# Altium schematic sheet MainDAC.SchDoc
size A2
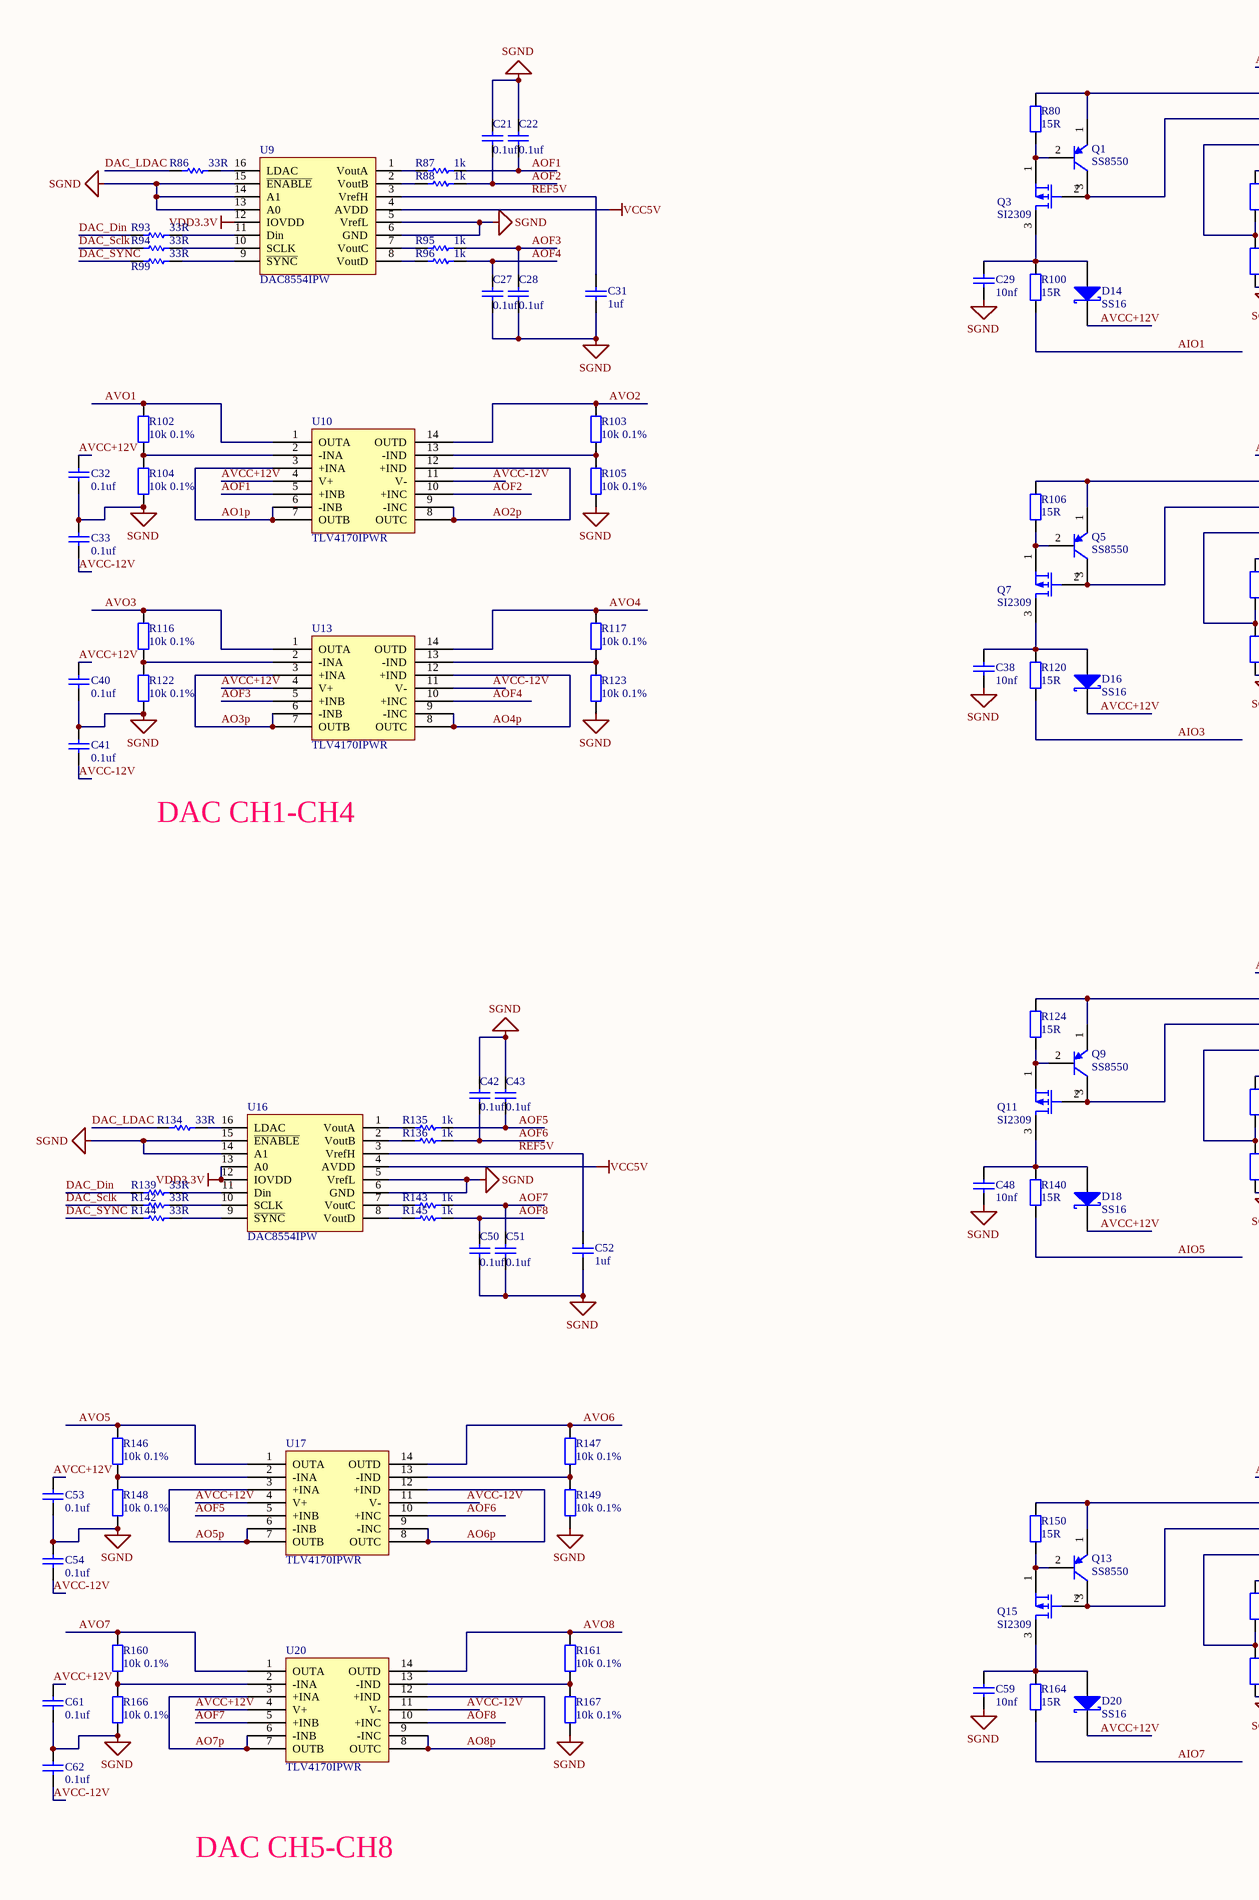
[diagram p0: MainDAC.SchDoc, left]
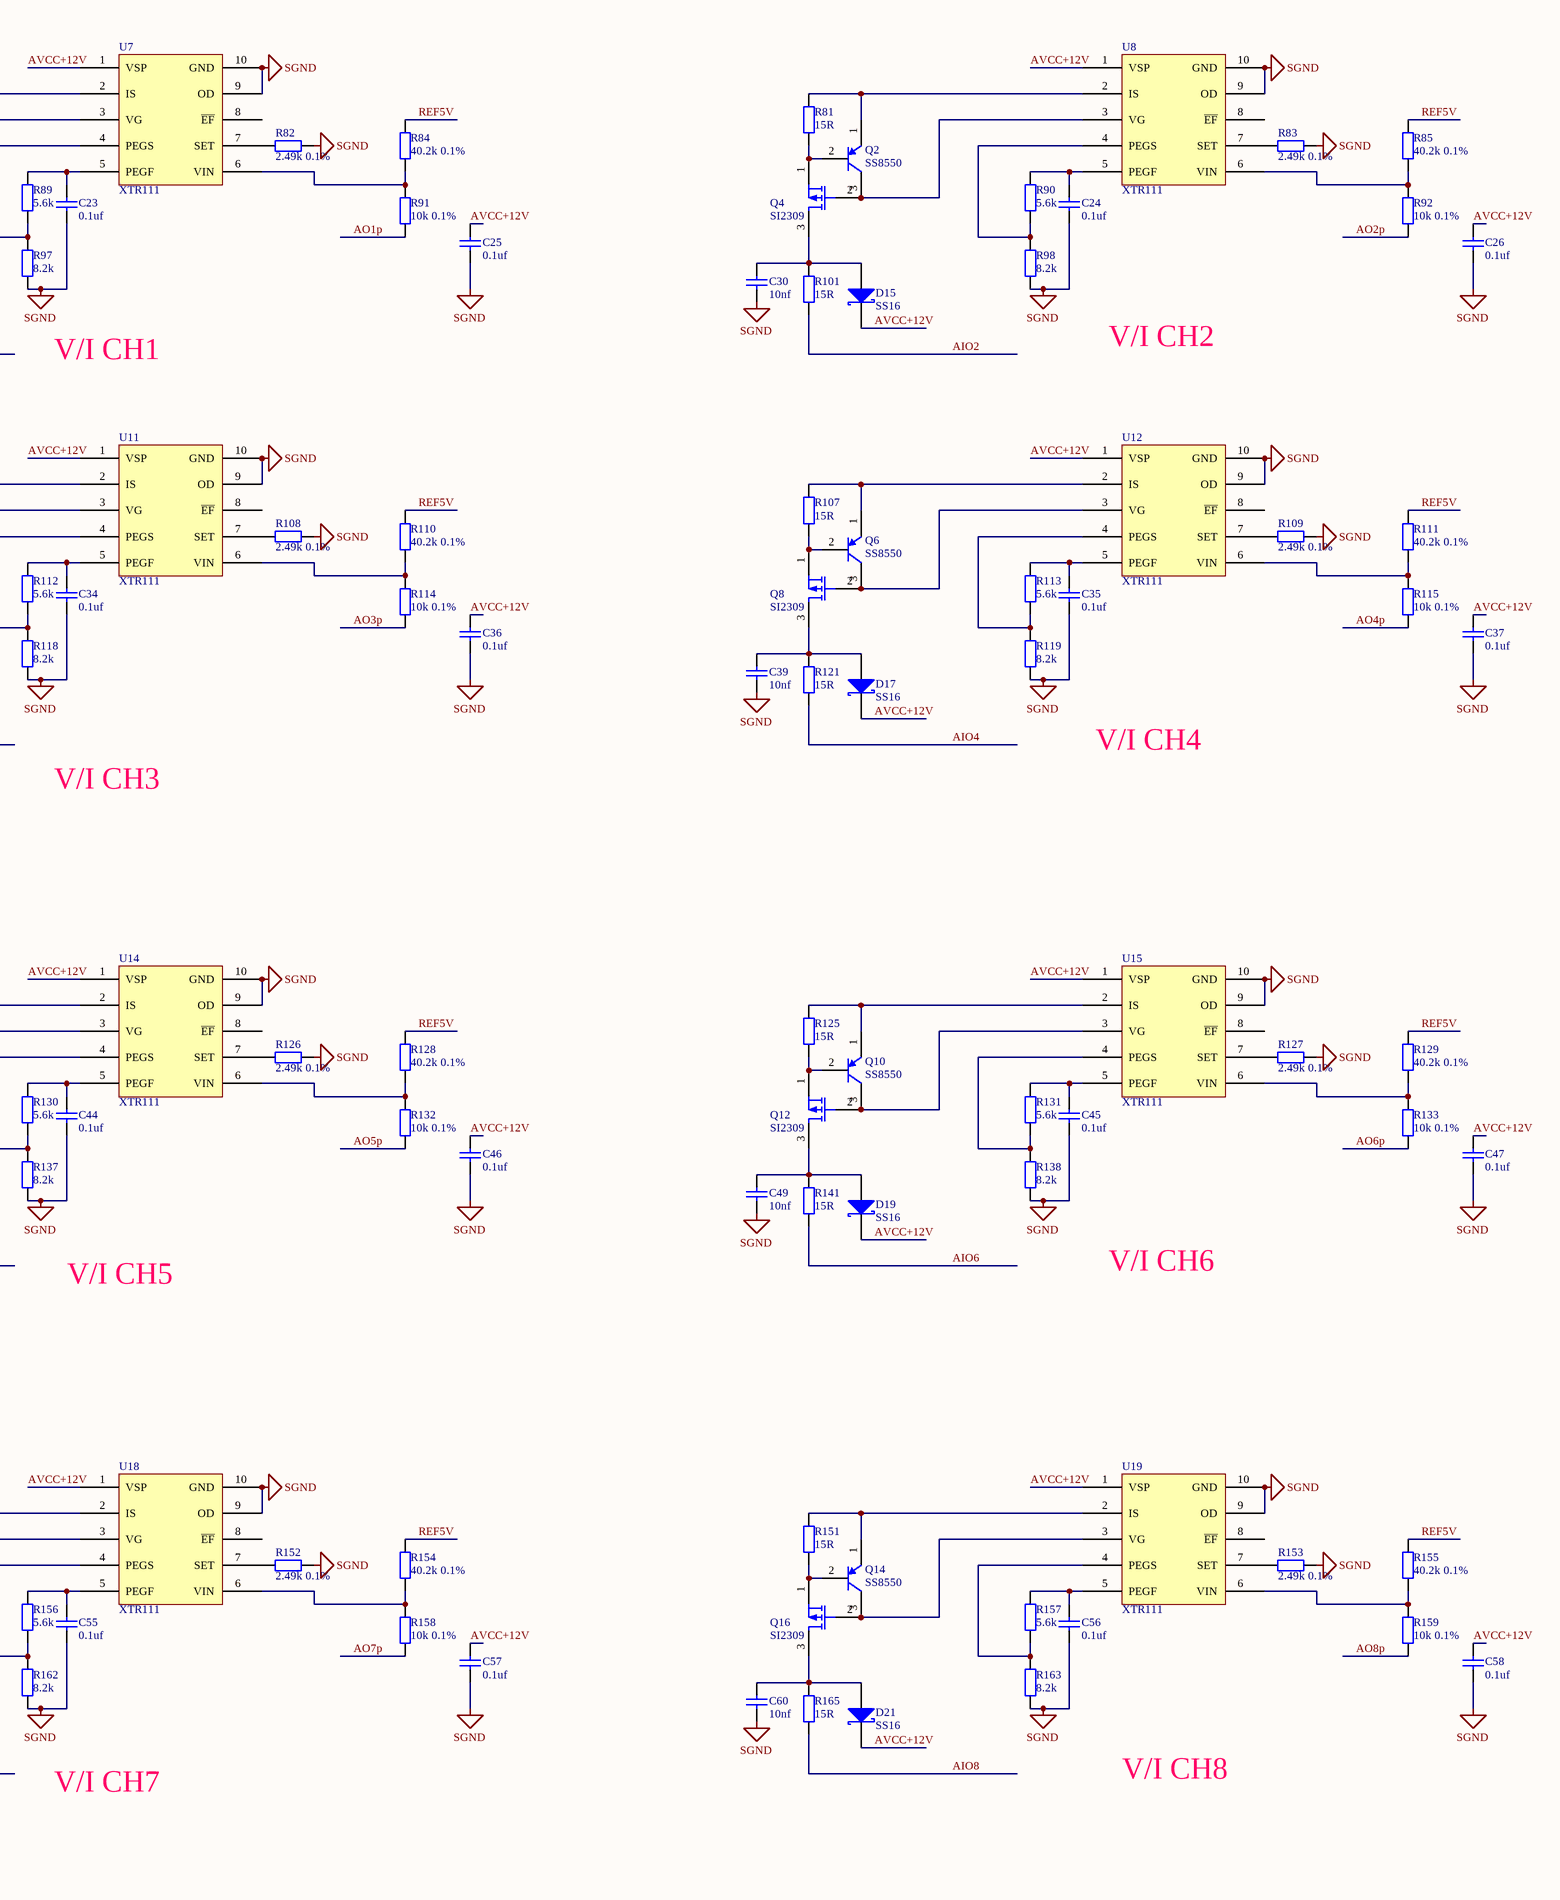
[diagram p1: MainDAC.SchDoc, right]

## Parts
C21  value 0.1uf  [C0805]  (hidden comment: Cap)
C22  value 0.1uf  [C0805]  (hidden comment: Cap)
C23  value 0.1uf  [C0805]  (hidden comment: Cap)
C24  value 0.1uf  [C0805]  (hidden comment: Cap)
C25  value 0.1uf  [C0805]  (hidden comment: Cap)
C26  value 0.1uf  [C0805]  (hidden comment: Cap)
C27  value 0.1uf  [C0805]  (hidden comment: Cap)
C28  value 0.1uf  [C0805]  (hidden comment: Cap)
C29  value 10nf  [C0805]  (hidden comment: Cap)
C30  value 10nf  [C0805]  (hidden comment: Cap)
C31  value 1uf  [C0805]  (hidden comment: Cap)
C32  value 0.1uf  [C0805]  (hidden comment: Cap)
C33  value 0.1uf  [C0805]  (hidden comment: Cap)
C34  value 0.1uf  [C0805]  (hidden comment: Cap)
C35  value 0.1uf  [C0805]  (hidden comment: Cap)
C36  value 0.1uf  [C0805]  (hidden comment: Cap)
C37  value 0.1uf  [C0805]  (hidden comment: Cap)
C38  value 10nf  [C0805]  (hidden comment: Cap)
C39  value 10nf  [C0805]  (hidden comment: Cap)
C40  value 0.1uf  [C0805]  (hidden comment: Cap)
C41  value 0.1uf  [C0805]  (hidden comment: Cap)
C42  value 0.1uf  [C0805]  (hidden comment: Cap)
C43  value 0.1uf  [C0805]  (hidden comment: Cap)
C44  value 0.1uf  [C0805]  (hidden comment: Cap)
C45  value 0.1uf  [C0805]  (hidden comment: Cap)
C46  value 0.1uf  [C0805]  (hidden comment: Cap)
C47  value 0.1uf  [C0805]  (hidden comment: Cap)
C48  value 10nf  [C0805]  (hidden comment: Cap)
C49  value 10nf  [C0805]  (hidden comment: Cap)
C50  value 0.1uf  [C0805]  (hidden comment: Cap)
C51  value 0.1uf  [C0805]  (hidden comment: Cap)
C52  value 1uf  [C0805]  (hidden comment: Cap)
C53  value 0.1uf  [C0805]  (hidden comment: Cap)
C54  value 0.1uf  [C0805]  (hidden comment: Cap)
C55  value 0.1uf  [C0805]  (hidden comment: Cap)
C56  value 0.1uf  [C0805]  (hidden comment: Cap)
C57  value 0.1uf  [C0805]  (hidden comment: Cap)
C58  value 0.1uf  [C0805]  (hidden comment: Cap)
C59  value 10nf  [C0805]  (hidden comment: Cap)
C60  value 10nf  [C0805]  (hidden comment: Cap)
C61  value 0.1uf  [C0805]  (hidden comment: Cap)
C62  value 0.1uf  [C0805]  (hidden comment: Cap)
D14  SS16  [SMB]
D15  SS16  [SMB]
D16  SS16  [SMB]
D17  SS16  [SMB]
D18  SS16  [SMB]
D19  SS16  [SMB]
D20  SS16  [SMB]
D21  SS16  [SMB]
Q1  SS8550  [sot-23]
Q2  SS8550  [sot-23]
Q3  SI2309  [sot-23]
Q4  SI2309  [sot-23]
Q5  SS8550  [sot-23]
Q6  SS8550  [sot-23]
Q7  SI2309  [sot-23]
Q8  SI2309  [sot-23]
Q9  SS8550  [sot-23]
Q10  SS8550  [sot-23]
Q11  SI2309  [sot-23]
Q12  SI2309  [sot-23]
Q13  SS8550  [sot-23]
Q14  SS8550  [sot-23]
Q15  SI2309  [sot-23]
Q16  SI2309  [sot-23]
R80  value 15R  [0805]  (hidden comment: Res2)
R81  value 15R  [0805]  (hidden comment: Res2)
R82  value 2.49k 0.1%  [0805]  (hidden comment: Res2)
R83  value 2.49k 0.1%  [0805]  (hidden comment: Res2)
R84  value 40.2k 0.1%  [0805]  (hidden comment: Res2)
R85  value 40.2k 0.1%  [0805]  (hidden comment: Res2)
R86  value 33R  [0805]  (hidden comment: Res Semi)
R87  value 1k  [0805]  (hidden comment: Res Semi)
R88  value 1k  [0805]  (hidden comment: Res Semi)
R89  value 5.6k  [0805]  (hidden comment: Res2)
R90  value 5.6k  [0805]  (hidden comment: Res2)
R91  value 10k 0.1%  [0805]  (hidden comment: Res2)
R92  value 10k 0.1%  [0805]  (hidden comment: Res2)
R93  value 33R  [0805]  (hidden comment: Res Semi)
R94  value 33R  [0805]  (hidden comment: Res Semi)
R95  value 1k  [0805]  (hidden comment: Res Semi)
R96  value 1k  [0805]  (hidden comment: Res Semi)
R97  value 8.2k  [0805]  (hidden comment: Res2)
R98  value 8.2k  [0805]  (hidden comment: Res2)
R99  value 33R  [0805]  (hidden comment: Res Semi)
R100  value 15R  [0805]  (hidden comment: Res2)
R101  value 15R  [0805]  (hidden comment: Res2)
R102  value 10k 0.1%  [0805]  (hidden comment: Res2)
R103  value 10k 0.1%  [0805]  (hidden comment: Res2)
R104  value 10k 0.1%  [0805]  (hidden comment: Res2)
R105  value 10k 0.1%  [0805]  (hidden comment: Res2)
R106  value 15R  [0805]  (hidden comment: Res2)
R107  value 15R  [0805]  (hidden comment: Res2)
R108  value 2.49k 0.1%  [0805]  (hidden comment: Res2)
R109  value 2.49k 0.1%  [0805]  (hidden comment: Res2)
R110  value 40.2k 0.1%  [0805]  (hidden comment: Res2)
R111  value 40.2k 0.1%  [0805]  (hidden comment: Res2)
R112  value 5.6k  [0805]  (hidden comment: Res2)
R113  value 5.6k  [0805]  (hidden comment: Res2)
R114  value 10k 0.1%  [0805]  (hidden comment: Res2)
R115  value 10k 0.1%  [0805]  (hidden comment: Res2)
R116  value 10k 0.1%  [0805]  (hidden comment: Res2)
R117  value 10k 0.1%  [0805]  (hidden comment: Res2)
R118  value 8.2k  [0805]  (hidden comment: Res2)
R119  value 8.2k  [0805]  (hidden comment: Res2)
R120  value 15R  [0805]  (hidden comment: Res2)
R121  value 15R  [0805]  (hidden comment: Res2)
R122  value 10k 0.1%  [0805]  (hidden comment: Res2)
R123  value 10k 0.1%  [0805]  (hidden comment: Res2)
R124  value 15R  [0805]  (hidden comment: Res2)
R125  value 15R  [0805]  (hidden comment: Res2)
R126  value 2.49k 0.1%  [0805]  (hidden comment: Res2)
R127  value 2.49k 0.1%  [0805]  (hidden comment: Res2)
R128  value 40.2k 0.1%  [0805]  (hidden comment: Res2)
R129  value 40.2k 0.1%  [0805]  (hidden comment: Res2)
R130  value 5.6k  [0805]  (hidden comment: Res2)
R131  value 5.6k  [0805]  (hidden comment: Res2)
R132  value 10k 0.1%  [0805]  (hidden comment: Res2)
R133  value 10k 0.1%  [0805]  (hidden comment: Res2)
R134  value 33R  [0805]  (hidden comment: Res Semi)
R135  value 1k  [0805]  (hidden comment: Res Semi)
R136  value 1k  [0805]  (hidden comment: Res Semi)
R137  value 8.2k  [0805]  (hidden comment: Res2)
R138  value 8.2k  [0805]  (hidden comment: Res2)
R139  value 33R  [0805]  (hidden comment: Res Semi)
R140  value 15R  [0805]  (hidden comment: Res2)
R141  value 15R  [0805]  (hidden comment: Res2)
R142  value 33R  [0805]  (hidden comment: Res Semi)
R143  value 1k  [0805]  (hidden comment: Res Semi)
R144  value 33R  [0805]  (hidden comment: Res Semi)
R145  value 1k  [0805]  (hidden comment: Res Semi)
R146  value 10k 0.1%  [0805]  (hidden comment: Res2)
R147  value 10k 0.1%  [0805]  (hidden comment: Res2)
R148  value 10k 0.1%  [0805]  (hidden comment: Res2)
R149  value 10k 0.1%  [0805]  (hidden comment: Res2)
R150  value 15R  [0805]  (hidden comment: Res2)
R151  value 15R  [0805]  (hidden comment: Res2)
R152  value 2.49k 0.1%  [0805]  (hidden comment: Res2)
R153  value 2.49k 0.1%  [0805]  (hidden comment: Res2)
R154  value 40.2k 0.1%  [0805]  (hidden comment: Res2)
R155  value 40.2k 0.1%  [0805]  (hidden comment: Res2)
R156  value 5.6k  [0805]  (hidden comment: Res2)
R157  value 5.6k  [0805]  (hidden comment: Res2)
R158  value 10k 0.1%  [0805]  (hidden comment: Res2)
R159  value 10k 0.1%  [0805]  (hidden comment: Res2)
R160  value 10k 0.1%  [0805]  (hidden comment: Res2)
R161  value 10k 0.1%  [0805]  (hidden comment: Res2)
R162  value 8.2k  [0805]  (hidden comment: Res2)
R163  value 8.2k  [0805]  (hidden comment: Res2)
R164  value 15R  [0805]  (hidden comment: Res2)
R165  value 15R  [0805]  (hidden comment: Res2)
R166  value 10k 0.1%  [0805]  (hidden comment: Res2)
R167  value 10k 0.1%  [0805]  (hidden comment: Res2)
U7  XTR111  [TSSOP-10_P]
U8  XTR111  [TSSOP-10_P]
U9  DAC8554IPW  [TSSOP16]
U10  TLV4170IPWR  [WSOP14*0.65]
U11  XTR111  [TSSOP-10_P]
U12  XTR111  [TSSOP-10_P]
U13  TLV4170IPWR  [WSOP14*0.65]
U14  XTR111  [TSSOP-10_P]
U15  XTR111  [TSSOP-10_P]
U16  DAC8554IPW  [TSSOP16]
U17  TLV4170IPWR  [WSOP14*0.65]
U18  XTR111  [TSSOP-10_P]
U19  XTR111  [TSSOP-10_P]
U20  TLV4170IPWR  [WSOP14*0.65]

## Nets
SGND: C21.1 C22.1 C23.2 C24.2 C25.2 C26.2 C27.2 C28.2 C29.2 C30.2 C31.1 C32.2 C33.1 C34.2 C35.2 C36.2 C37.2 C38.2 C39.2 C40.2 C41.1 C42.1 C43.1 C44.2 C45.2 C46.2 C47.2 C48.2 C49.2 C50.2 C51.2 C52.1 C53.2 C54.1 C55.2 C56.2 C57.2 C58.2 C59.2 C60.2 C61.2 C62.1 R82.2 R83.2 R97.2 R98.2 R104.2 R105.2 R108.2 R109.2 R118.2 R119.2 R122.2 R123.2 R126.2 R127.2 R137.2 R138.2 R148.2 R149.2 R152.2 R153.2 R162.2 R163.2 R166.2 R167.2 U7.9(OD) U7.10(GND) U8.9(OD) U8.10(GND) U9.5(VrefL) U9.6(GND) U9.13(A0) U9.14(A1) U9.15(~{ENABLE}) U11.9(OD) U11.10(GND) U12.9(OD) U12.10(GND) U14.9(OD) U14.10(GND) U15.9(OD) U15.10(GND) U16.5(VrefL) U16.6(GND) U16.14(A1) U16.15(~{ENABLE}) U18.9(OD) U18.10(GND) U19.9(OD) U19.10(GND)
VCC5V: U9.4(AVDD) U16.4(AVDD)
VDD3.3V: U9.12(IOVDD) U16.12(IOVDD) U16.13(A0)
AIO1: R100.2
AIO2: R101.2
AIO3: R120.2
AIO4: R121.2
AIO5: R140.2
AIO6: R141.2
AIO7: R164.2
AIO8: R165.2
AO1p: R91.2 U10.3(+INA) U10.6(-INB) U10.7(OUTB)
AO2p: R92.2 U10.8(OUTC) U10.9(-INC) U10.12(+IND)
AO3p: R114.2 U13.3(+INA) U13.6(-INB) U13.7(OUTB)
AO4p: R115.2 U13.8(OUTC) U13.9(-INC) U13.12(+IND)
AO5p: R132.2 U17.3(+INA) U17.6(-INB) U17.7(OUTB)
AO6p: R133.2 U17.8(OUTC) U17.9(-INC) U17.12(+IND)
AO7p: R158.2 U20.3(+INA) U20.6(-INB) U20.7(OUTB)
AO8p: R159.2 U20.8(OUTC) U20.9(-INC) U20.12(+IND)
AOF1: C22.2 R87.1 U10.5(+INB)
AOF2: C21.2 R88.1 U10.10(+INC)
AOF3: C28.1 R95.1 U13.5(+INB)
AOF4: C27.1 R96.1 U13.10(+INC)
AOF5: C43.2 R135.1 U17.5(+INB)
AOF6: C42.2 R136.1 U17.10(+INC)
AOF7: C51.1 R143.1 U20.5(+INB)
AOF8: C50.1 R145.1 U20.10(+INC)
AVCC+12V: C25.1 C26.1 C32.1 C36.1 C37.1 C40.1 C46.1 C47.1 C53.1 C57.1 C58.1 C61.1 D14.2(K) D15.2(K) D16.2(K) D17.2(K) D18.2(K) D19.2(K) D20.2(K) D21.2(K) U7.1(VSP) U8.1(VSP) U10.4(V+) U11.1(VSP) U12.1(VSP) U13.4(V+) U14.1(VSP) U15.1(VSP) U17.4(V+) U18.1(VSP) U19.1(VSP) U20.4(V+)
AVCC-12V: C33.2 C41.2 C54.2 C62.2 U10.11(V-) U13.11(V-) U17.11(V-) U20.11(V-)
AVO1: R102.1 U10.1(OUTA)
AVO2: R103.1 U10.14(OUTD)
AVO3: R116.1 U13.1(OUTA)
AVO4: R117.1 U13.14(OUTD)
AVO5: R146.1 U17.1(OUTA)
AVO6: R147.1 U17.14(OUTD)
AVO7: R160.1 U20.1(OUTA)
AVO8: R161.1 U20.14(OUTD)
DAC_Din: R93.2 R139.2
DAC_LDAC: R86.2 R134.2
DAC_Sclk: R94.2 R142.2
DAC_SYNC: R99.2 R144.2
REF5V: C31.2 C52.2 R84.1 R85.1 R110.1 R111.1 R128.1 R129.1 R154.1 R155.1 U9.3(VrefH) U16.3(VrefH)
NetC23_1: C23.1 R89.1 U7.5(PEGF)
NetC24_1: C24.1 R90.1 U8.5(PEGF)
NetC29_1: C29.1 D14.1(A) Q3.3(D) R100.1
NetC30_1: C30.1 D15.1(A) Q4.3(D) R101.1
NetC34_1: C34.1 R112.1 U11.5(PEGF)
NetC35_1: C35.1 R113.1 U12.5(PEGF)
NetC38_1: C38.1 D16.1(A) Q7.3(D) R120.1
NetC39_1: C39.1 D17.1(A) Q8.3(D) R121.1
NetC44_1: C44.1 R130.1 U14.5(PEGF)
NetC45_1: C45.1 R131.1 U15.5(PEGF)
NetC48_1: C48.1 D18.1(A) Q11.3(D) R140.1
NetC49_1: C49.1 D19.1(A) Q12.3(D) R141.1
NetC55_1: C55.1 R156.1 U18.5(PEGF)
NetC56_1: C56.1 R157.1 U19.5(PEGF)
NetC59_1: C59.1 D20.1(A) Q15.3(D) R164.1
NetC60_1: C60.1 D21.1(A) Q16.3(D) R165.1
NetQ1_1: Q1.1(E) R80.1 U7.2(IS)
NetQ1_2: Q1.2(B) Q3.1(S) R80.2
NetQ1_3: Q1.3(C) Q3.2(G) U7.3(VG)
NetQ2_1: Q2.1(E) R81.1 U8.2(IS)
NetQ2_2: Q2.2(B) Q4.1(S) R81.2
NetQ2_3: Q2.3(C) Q4.2(G) U8.3(VG)
NetQ5_1: Q5.1(E) R106.1 U11.2(IS)
NetQ5_2: Q5.2(B) Q7.1(S) R106.2
NetQ5_3: Q5.3(C) Q7.2(G) U11.3(VG)
NetQ6_1: Q6.1(E) R107.1 U12.2(IS)
NetQ6_2: Q6.2(B) Q8.1(S) R107.2
NetQ6_3: Q6.3(C) Q8.2(G) U12.3(VG)
NetQ9_1: Q9.1(E) R124.1 U14.2(IS)
NetQ9_2: Q9.2(B) Q11.1(S) R124.2
NetQ9_3: Q9.3(C) Q11.2(G) U14.3(VG)
NetQ10_1: Q10.1(E) R125.1 U15.2(IS)
NetQ10_2: Q10.2(B) Q12.1(S) R125.2
NetQ10_3: Q10.3(C) Q12.2(G) U15.3(VG)
NetQ13_1: Q13.1(E) R150.1 U18.2(IS)
NetQ13_2: Q13.2(B) Q15.1(S) R150.2
NetQ13_3: Q13.3(C) Q15.2(G) U18.3(VG)
NetQ14_1: Q14.1(E) R151.1 U19.2(IS)
NetQ14_2: Q14.2(B) Q16.1(S) R151.2
NetQ14_3: Q14.3(C) Q16.2(G) U19.3(VG)
NetR82_1: R82.1 U7.7(SET)
NetR83_1: R83.1 U8.7(SET)
NetR84_2: R84.2 R91.1 U7.6(VIN)
NetR85_2: R85.2 R92.1 U8.6(VIN)
NetR86_1: R86.1 U9.16(LDAC)
NetR87_2: R87.2 U9.1(VoutA)
NetR88_2: R88.2 U9.2(VoutB)
NetR89_2: R89.2 R97.1 U7.4(PEGS)
NetR90_2: R90.2 R98.1 U8.4(PEGS)
NetR93_1: R93.1 U9.11(Din)
NetR94_1: R94.1 U9.10(SCLK)
NetR95_2: R95.2 U9.7(VoutC)
NetR96_2: R96.2 U9.8(VoutD)
NetR99_1: R99.1 U9.9(~{SYNC})
NetR102_2: R102.2 R104.1 U10.2(-INA)
NetR103_2: R103.2 R105.1 U10.13(-IND)
NetR108_1: R108.1 U11.7(SET)
NetR109_1: R109.1 U12.7(SET)
NetR110_2: R110.2 R114.1 U11.6(VIN)
NetR111_2: R111.2 R115.1 U12.6(VIN)
NetR112_2: R112.2 R118.1 U11.4(PEGS)
NetR113_2: R113.2 R119.1 U12.4(PEGS)
NetR116_2: R116.2 R122.1 U13.2(-INA)
NetR117_2: R117.2 R123.1 U13.13(-IND)
NetR126_1: R126.1 U14.7(SET)
NetR127_1: R127.1 U15.7(SET)
NetR128_2: R128.2 R132.1 U14.6(VIN)
NetR129_2: R129.2 R133.1 U15.6(VIN)
NetR130_2: R130.2 R137.1 U14.4(PEGS)
NetR131_2: R131.2 R138.1 U15.4(PEGS)
NetR134_1: R134.1 U16.16(LDAC)
NetR135_2: R135.2 U16.1(VoutA)
NetR136_2: R136.2 U16.2(VoutB)
NetR139_1: R139.1 U16.11(Din)
NetR142_1: R142.1 U16.10(SCLK)
NetR143_2: R143.2 U16.7(VoutC)
NetR144_1: R144.1 U16.9(~{SYNC})
NetR145_2: R145.2 U16.8(VoutD)
NetR146_2: R146.2 R148.1 U17.2(-INA)
NetR147_2: R147.2 R149.1 U17.13(-IND)
NetR152_1: R152.1 U18.7(SET)
NetR153_1: R153.1 U19.7(SET)
NetR154_2: R154.2 R158.1 U18.6(VIN)
NetR155_2: R155.2 R159.1 U19.6(VIN)
NetR156_2: R156.2 R162.1 U18.4(PEGS)
NetR157_2: R157.2 R163.1 U19.4(PEGS)
NetR160_2: R160.2 R166.1 U20.2(-INA)
NetR161_2: R161.2 R167.1 U20.13(-IND)

Not connected (* = marked no-connect by the designer): U7 8(~{EF}); U8 8(~{EF}); U11 8(~{EF}); U12 8(~{EF}); U14 8(~{EF}); U15 8(~{EF}); U18 8(~{EF}); U19 8(~{EF})

## Notes on the sheet
- V/I CH1
- V/I CH2
- V/I CH4
- DAC CH1-CH4
- V/I CH3
- V/I CH5
- V/I CH6
- V/I CH7
- V/I CH8
- DAC CH5-CH8

## Library data of the parts
C21-C62 = Cap: Capacitor; Manufacturer: Generic Components; Class: Passive; Published: 08/06/2000; Publisher: Altium Hobart Technology Centre; SubClass: Capacitor
D14-D21 = D Schottky: Schottky Diode; Published: 8-Jun-2000; LatestRevisionDate: 17-Jul-2002; LatestRevisionNote: Re-released for DXP Platform.; PackageReference: SMB; Publisher: Altium Limited; Code_JEDEC: DO-214-AA
Q1 Q2 Q5 Q6 Q9 Q10 Q13 Q14 = 2N3906: PNP General Purpose Amplifier; Published: 8-Jun-2000; LatestRevisionDate: 15-Jan-2003; LatestRevisionNote: PCB Footprint 'BCY-W3/D4.7' replaced; DatasheetVersion: 1997; PackageVersion: Sep-1998; PackageReference: TO-92A; Publisher: Altium Limited; PackageDescription: TO, Flat Index; 3 In-Line, Axial Leads; Body Dia. 4.5mm; Leads 0.51 x 0.48 mm (max); ComponentLink1Description: Manufacturer Link; ComponentLink1URL: http://www.fairchildsemi.com/; ComponentLink2Description: Datasheet; ComponentLink2URL: http://www.fairchildsemi.com/ds/2N%2F2N3906.pdf
Q3 Q4 Q7 Q8 Q11 Q12 Q15 Q16 = MOSFET-P: P-Channel MOSFET; Published: 8-Jun-2000; LatestRevisionDate: 17-Jul-2002; LatestRevisionNote: Re-released for DXP Platform.; PackageVersion: 1995/1996; PackageReference: E3; Publisher: Altium Limited; PackageDescription: TO, Flat Index; 3 In-Line, Axial Leads; Body Dia. 4.6mm; Lead Dia. 0.5 mm (max)
R80-R85 R89-R92 R97 R98 R100-R133 R137 R138 R140 R141 R146-R167 = RES
R86-R88 R93-R96 R99 R134-R136 R139 R142-R145 = Res Semi: Semiconductor Resistor; Published: 8-Jun-2000; LatestRevisionDate: 17-Jul-2002; LatestRevisionNote: Re-released for DXP Platform.; PackageReference: AXIAL-0.5; Publisher: Altium Limited
U7 U8 U11 U12 U14 U15 U18 U19 = XT
U9 U16 = DAC8554
U10 U13 U17 U20 = TLV41